# Altium schematic sheet Output_Isolation.SchDoc
size A; SheetNumber: 8; SheetTotal: 16
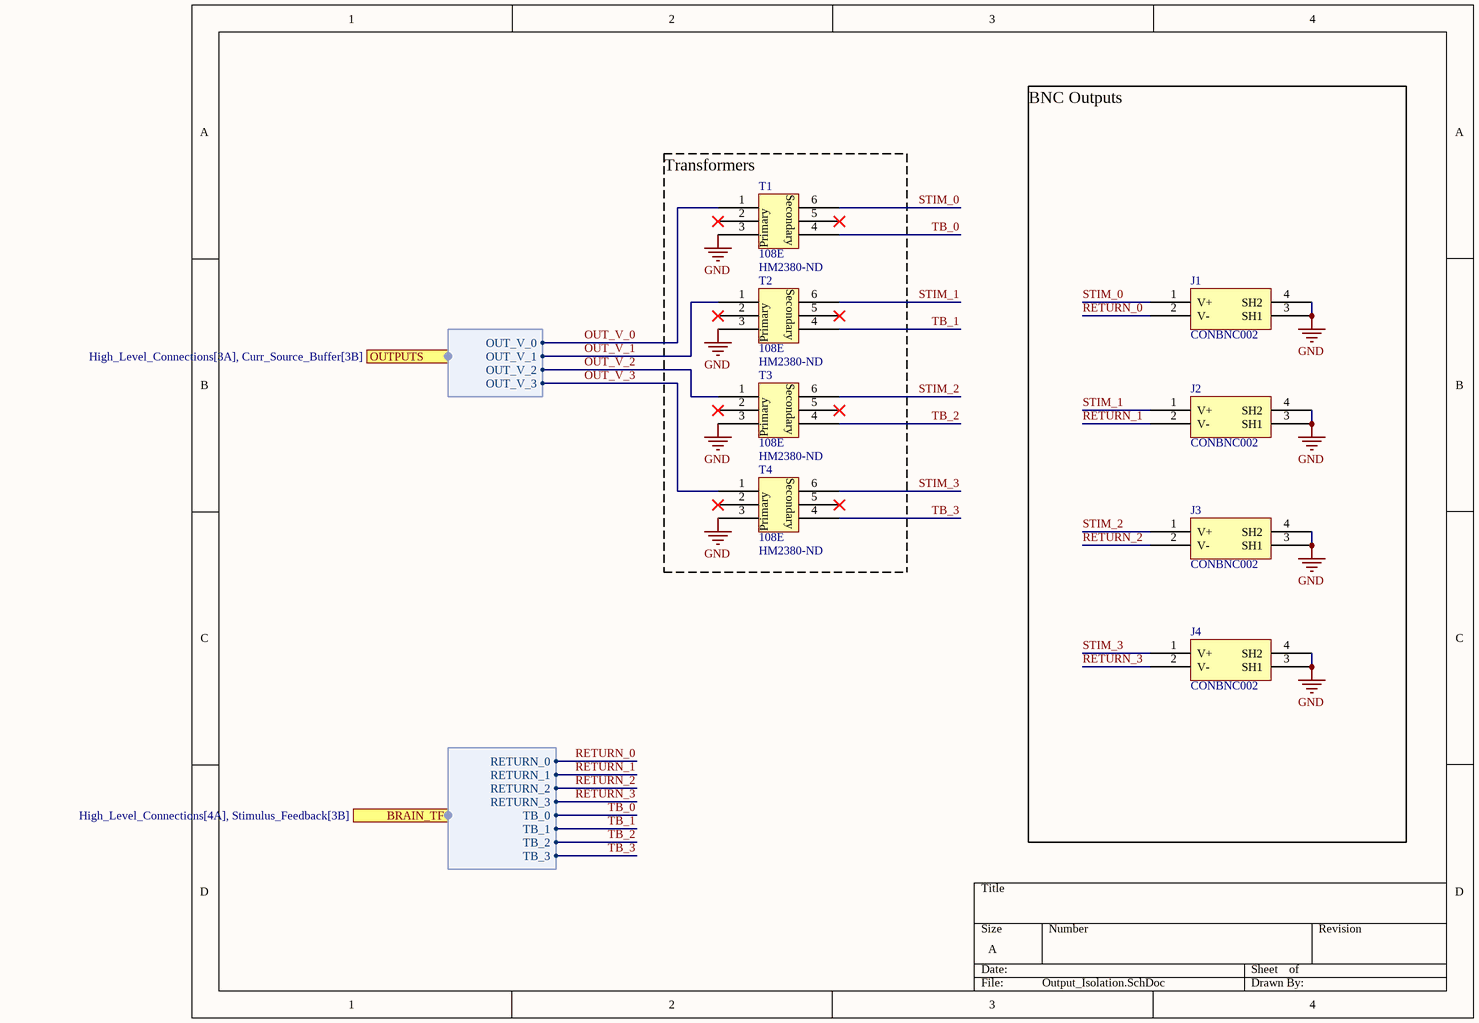
[diagram p0: Output_Isolation.SchDoc]

## Parts
J1  BNC Connector  [CONBNC002]  (value not drawn)
J2  BNC Connector  [CONBNC002]  (value not drawn)
J3  BNC Connector  [CONBNC002]  (value not drawn)
J4  BNC Connector  [CONBNC002]  (value not drawn)
T1  108E  Supplier Part Number 1: HM2380-ND  [108E]
T2  108E  Supplier Part Number 1: HM2380-ND  [108E]
T3  108E  Supplier Part Number 1: HM2380-ND  [108E]
T4  108E  Supplier Part Number 1: HM2380-ND  [108E]

## Blocks framed on the sheet
BNC Outputs: J1-J4
Transformers: T1-T4

## Ports
BRAIN_TF (harness Brain_Trans_Conn, see High_Level_Connections[4A], Stimulus_Feedback[3B]), OUTPUTS (harness OUTPUT_VOLTAGES, see High_Level_Connections[3A], Curr_Source_Buffer[3B])

## Harnesses
OUTPUT_VOLTAGES: OUT_V_0, OUT_V_1, OUT_V_2, OUT_V_3
Brain_Trans_Conn: RETURN_0, RETURN_1, RETURN_2, RETURN_3, TB_0, TB_1, TB_2, TB_3

## Nets
GND: J1.3(SH1) J1.4(SH2) J2.3(SH1) J2.4(SH2) J3.3(SH1) J3.4(SH2) J4.3(SH1) J4.4(SH2) T1.3 T2.3 T3.3 T4.3
OUT_V_0: T1.1 ; port OUTPUTS.OUT_V_0
OUT_V_1: T2.1 ; port OUTPUTS.OUT_V_1
OUT_V_2: T3.1 ; port OUTPUTS.OUT_V_2
OUT_V_3: T4.1 ; port OUTPUTS.OUT_V_3
RETURN_0: J1.2(V-) ; port BRAIN_TF.RETURN_0
RETURN_1: J2.2(V-) ; port BRAIN_TF.RETURN_1
RETURN_2: J3.2(V-) ; port BRAIN_TF.RETURN_2
RETURN_3: J4.2(V-) ; port BRAIN_TF.RETURN_3
STIM_0: J1.1(V+) T1.6
STIM_1: J2.1(V+) T2.6
STIM_2: J3.1(V+) T3.6
STIM_3: J4.1(V+) T4.6
TB_0: T1.4 ; port BRAIN_TF.TB_0
TB_1: T2.4 ; port BRAIN_TF.TB_1
TB_2: T3.4 ; port BRAIN_TF.TB_2
TB_3: T4.4 ; port BRAIN_TF.TB_3

Not connected (* = marked no-connect by the designer): T1 2* 5*; T2 2* 5*; T3 2* 5*; T4 2* 5*

## Notes on the sheet
- (in symbol 108E) Secondary; Primary

## Library data of the parts
J1-J4 = CONBNC002: Supplier 1: Newark; Supplier Part Number 1: CONBNC002
T1-T4 = 108E: Supplier 1: DigiKey